# Altium schematic sheet APCI0078-P002A_C74981361_APCI0078-P002A_C7498136.schdoc.schdoc
size 127 x 114 mm
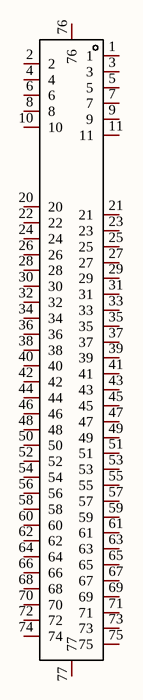
[diagram p0: APCI0078-P002A_C74981361_APCI0078-P002A_C7498136.schdoc.schdoc]

## Parts
CN?  APCI0078-P002A_C7498136  [NGFF-SMD_APCI0078-P002A]  (value not drawn)

## Nets

Not connected (* = marked no-connect by the designer): CN? 1 2 3 4 5 6 7 8 9 10 11 20 21 22 23 24 25 26 27 28 29 30 31 32 33 34 35 36 37 38 39 40 41 42 43 44 45 46 47 48 49 50 51 52 53 54 55 56 57 58 59 60 61 62 63 64 65 66 67 68 69 70 71 72 73 74 75 76 77

## Library data of the parts
CN? = APCI0078-P002A_C7498136: Manufacturer: LX(连欣科技); Add into BOM: yes; Connector Type: M.2; Pitch: 0.5mm; Symbol: APCI0078-P002A_C7498136; Device: APCI0078-P002A_C7498136; Supplier: LCSC; Supplier Part: C7498136; Manufacturer Part: APCI0078-P002A; JLCPCB Part Class: Extended Part; LCSC Part Name: M.2(NGFF)连接器67PIN KEY-B型 H3.2MM（可配螺柱）; Supplier Footprint: SMD,P=0.5mm,卧贴; Datasheet: https://atta.szlcsc.com/upload/public/pdf/source/20230918/968CC5EFA479112182B1AF662CC27BAA.pdf; Convert to PCB: yes; Number of Pins: 67P; Mounting Style: 卧贴; Height Above Board: 3.2mm